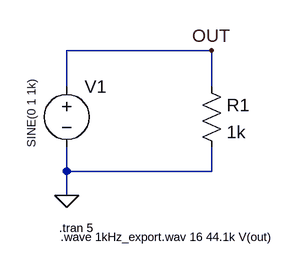
[diagram p0: schematic Exporting_WAV.asc]
Exporting_WAV.asc, the LTspice schematic file:
Version 4
SHEET 1 880 680
WIRE 224 80 32 80
WIRE 32 128 32 80
WIRE 224 128 224 80
WIRE 32 240 32 208
WIRE 224 240 224 208
WIRE 224 240 32 240
WIRE 32 272 32 240
FLAG 32 272 0
FLAG 224 80 OUT
SYMBOL voltage 32 112 R0
WINDOW 3 -46 5 VRight 1
WINDOW 123 0 0 Left 0
WINDOW 39 0 0 Left 0
SYMATTR InstName V1
SYMATTR Value SINE(0 1 1k)
SYMBOL res 208 112 R0
SYMATTR InstName R1
SYMATTR Value 1k
TEXT 22 316 Left 1 !.tran 5
TEXT 24 328 Left 1 !.wave 1kHz_export.wav 16 44.1k V(out)

The netlist it stands for:
* Exporting_WAV.asc
V1 OUT 0 SINE(0 1 1k)
R1 OUT 0 1k
.tran 5
.wave 1kHz_export.wav 16 44.1k V(out)
.backanno
.end